# EAGLE design connect24x16 (EAGLE 5.11)
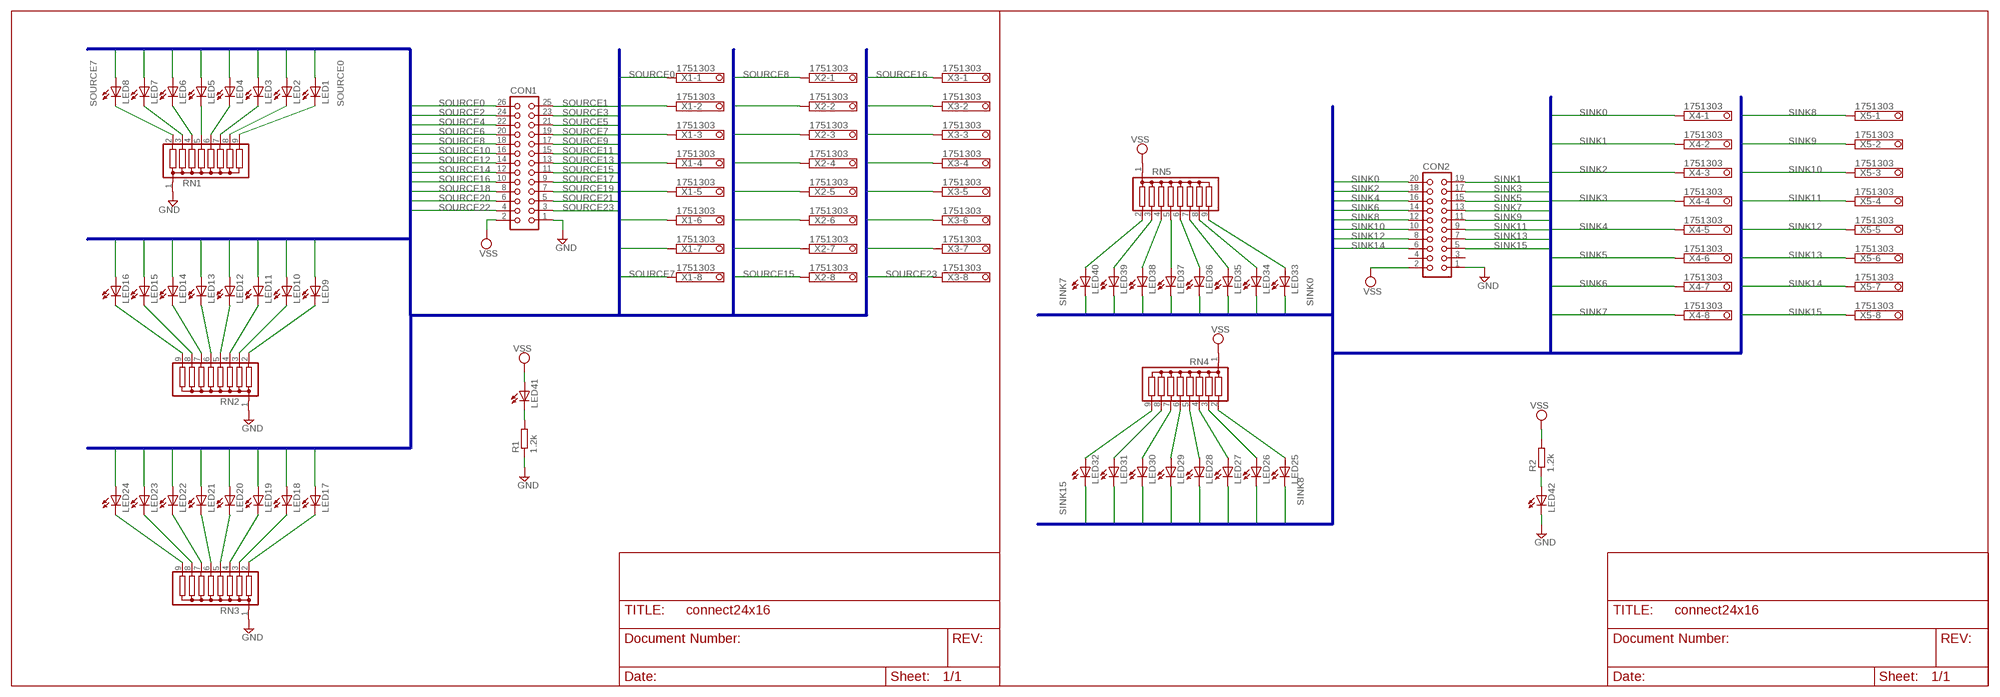
[diagram p0: schematic, sheet 1]

## Parts
CON1  CON-HARTING_CON26L  [CON-HARTING_CON26L]
CON2  CON-HARTING_CON20L  [CON-HARTING_CON20L]
LED1  LEDLZR181  [LZR181]
LED2  LEDLZR181  [LZR181]
LED3  LEDLZR181  [LZR181]
LED4  LEDLZR181  [LZR181]
LED5  LEDLZR181  [LZR181]
LED6  LEDLZR181  [LZR181]
LED7  LEDLZR181  [LZR181]
LED8  LEDLZR181  [LZR181]
LED9  LEDLZR181  [LZR181]
LED10  LEDLZR181  [LZR181]
LED11  LEDLZR181  [LZR181]
LED12  LEDLZR181  [LZR181]
LED13  LEDLZR181  [LZR181]
LED14  LEDLZR181  [LZR181]
LED15  LEDLZR181  [LZR181]
LED16  LEDLZR181  [LZR181]
LED17  LEDLZR181  [LZR181]
LED18  LEDLZR181  [LZR181]
LED19  LEDLZR181  [LZR181]
LED20  LEDLZR181  [LZR181]
LED21  LEDLZR181  [LZR181]
LED22  LEDLZR181  [LZR181]
LED23  LEDLZR181  [LZR181]
LED24  LEDLZR181  [LZR181]
LED25  LEDLZR181  [LZR181]
LED26  LEDLZR181  [LZR181]
LED27  LEDLZR181  [LZR181]
LED28  LEDLZR181  [LZR181]
LED29  LEDLZR181  [LZR181]
LED30  LEDLZR181  [LZR181]
LED31  LEDLZR181  [LZR181]
LED32  LEDLZR181  [LZR181]
LED33  LEDLZR181  [LZR181]
LED34  LEDLZR181  [LZR181]
LED35  LEDLZR181  [LZR181]
LED36  LEDLZR181  [LZR181]
LED37  LEDLZR181  [LZR181]
LED38  LEDLZR181  [LZR181]
LED39  LEDLZR181  [LZR181]
LED40  LEDLZR181  [LZR181]
LED41  LED3MM  [LED3MM]
LED42  LED3MM  [LED3MM]
R1  1.2k  R-EU_0207/10  [0207/10]
R2  1.2k  R-EU_0207/10  [0207/10]
RN1  G08R  [SIL9]
RN2  G08R  [SIL9]
RN3  G08R  [SIL9]
RN4  G08R  [SIL9]
RN5  G08R  [SIL9]
X1  1751303  [1751303]
X2  1751303  [1751303]
X3  1751303  [1751303]
X4  1751303  [1751303]
X5  1751303  [1751303]

## Nets
GND1: CON1.1 R1.1 RN1.1 RN2.1 RN3.1 ; supply symbol labelled GND
GND2: CON2.1 LED42.K(C) ; supply symbol labelled GND
N$1: LED8.K(C) RN1.2
N$2: LED7.K(C) RN1.3
N$3: LED6.K(C) RN1.4
N$4: LED5.K(C) RN1.5
N$5: LED4.K(C) RN1.6
N$6: LED3.K(C) RN1.7
N$7: LED2.K(C) RN1.8
N$8: LED1.K(C) RN1.9
N$9: LED16.K(C) RN2.9
N$10: LED15.K(C) RN2.8
N$11: LED14.K(C) RN2.7
N$12: LED13.K(C) RN2.6
N$13: LED12.K(C) RN2.5
N$14: LED11.K(C) RN2.4
N$15: LED10.K(C) RN2.3
N$16: LED9.K(C) RN2.2
N$17: LED24.K(C) RN3.9
N$18: LED23.K(C) RN3.8
N$19: LED22.K(C) RN3.7
N$20: LED21.K(C) RN3.6
N$21: LED20.K(C) RN3.5
N$22: LED19.K(C) RN3.4
N$23: LED18.K(C) RN3.3
N$24: LED17.K(C) RN3.2
N$25: LED41.K(C) R1.2
N$26: LED40.A RN5.2
N$27: LED39.A RN5.3
N$28: LED38.A RN5.4
N$29: LED32.A RN4.9
N$30: LED31.A RN4.8
N$31: LED30.A RN4.7
N$32: LED29.A RN4.6
N$33: LED28.A RN4.5
N$34: LED27.A RN4.4
N$35: LED26.A RN4.3
N$36: LED25.A RN4.2
N$37: LED37.A RN5.5
N$38: LED36.A RN5.6
N$39: LED35.A RN5.7
N$40: LED34.A RN5.8
N$41: LED33.A RN5.9
N$42: LED42.A R2.1
SINK0: CON2.20 LED33.K(C) X4.1
SINK1: CON2.19 LED34.K(C) X4.2
SINK2: CON2.18 LED35.K(C) X4.3
SINK3: CON2.17 LED36.K(C) X4.4
SINK4: CON2.16 LED37.K(C) X4.5
SINK5: CON2.15 LED38.K(C) X4.6
SINK6: CON2.14 LED39.K(C) X4.7
SINK7: CON2.13 LED40.K(C) X4.8
SINK8: CON2.12 LED25.K(C) X5.1
SINK9: CON2.11 LED26.K(C) X5.2
SINK10: CON2.10 LED27.K(C) X5.3
SINK11: CON2.9 LED28.K(C) X5.4
SINK12: CON2.8 LED29.K(C) X5.5
SINK13: CON2.7 LED30.K(C) X5.6
SINK14: CON2.6 LED31.K(C) X5.7
SINK15: CON2.5 LED32.K(C) X5.8
SOURCE0: CON1.26 LED1.A X1.1
SOURCE1: CON1.25 LED2.A X1.2
SOURCE2: CON1.24 LED3.A X1.3
SOURCE3: CON1.23 LED4.A X1.4
SOURCE4: CON1.22 LED5.A X1.5
SOURCE5: CON1.21 LED6.A X1.6
SOURCE6: CON1.20 LED7.A X1.7
SOURCE7: CON1.19 LED8.A X1.8
SOURCE8: CON1.18 LED9.A X2.1
SOURCE9: CON1.17 LED10.A X2.2
SOURCE10: CON1.16 LED11.A X2.3
SOURCE11: CON1.15 LED12.A X2.4
SOURCE12: CON1.14 LED13.A X2.5
SOURCE13: CON1.13 LED14.A X2.6
SOURCE14: CON1.12 LED15.A X2.7
SOURCE15: CON1.11 LED16.A X2.8
SOURCE16: CON1.10 LED17.A X3.1
SOURCE17: CON1.9 LED18.A X3.2
SOURCE18: CON1.8 LED19.A X3.3
SOURCE19: CON1.7 LED20.A X3.4
SOURCE20: CON1.6 LED21.A X3.5
SOURCE21: CON1.5 LED22.A X3.6
SOURCE22: CON1.4 LED23.A X3.7
SOURCE23: CON1.3 LED24.A X3.8
VSS: CON1.2 CON2.2 LED41.A R2.2 RN4.1 RN5.1
Unconnected: CON2.3 CON2.4

## Buses
SOURCE[0..23]
SINK[0..15]

## Library data of the parts
CON1 = connect24x16:CON-HARTING_CON26L: CONNECTOR
CON2 = connect24x16:CON-HARTING_CON20L: CONNECTOR
LED1-LED42 = led:LED: LED OSRAM: - CHIPLED LG R971, LG N971, LY N971, LG Q971, LY Q971, LO R971, LY R971 LH N974, LH R974 LS Q976, LO Q976, LY Q976 LO Q996 - Hyper CHIPLED LW Q18S LB Q993, LB Q99A, LB R99A - SideLED LS A670, LO A670, LY A670, LG A670, LP A670 LB A673, LV A673, LT A673, LW A673 LH A674 LY A675 LS A676, LA A676, LO A676, LY A676, LW A676 LS A679, LY A679, LG A679 - Hyper Micro SIDELED® LS Y876, LA Y876, LO Y876, LY Y876 LT Y87S - SmartLED LW L88C, LW L88S LB L89C, LB L89S, LG L890 LS L89K, LO L89K, LY L89K LS L896, LA L896, LO L896, LY L896 - TOPLED LS T670, LO T670, LY T670, LG T670, LP T670 LSG T670, LSP T670, LSY T670, LOP T670, LYG T670 LG T671, LOG T671, LSG T671 LB T673, LV T673, LT T673, LW T673 LH T674 LS T676, LA T676, LO T676, LY T676, LB T676, LH T676, LSB T676, LW T676 LB T67C, LV T67C, LT T67C, LS T67K, LO T67K, LY T67K, LW E67C LS E67B, LA E67B, LO E67B, LY E67B, LB E67C, LV E67C, LT E67C LW T67C LS T679, LY T679, LG T679 LS T770, LO T770, LY T770, LG T770, LP T770 LB T773, LV T773, LT T773, LW T773 LH T774 LS E675, LA E675, LY E675, LS T675 LS T776, LA T776, LO T776, LY T776, LB T776 LHGB T686 LT T68C, LB T68C - Hyper Mini TOPLED® LB M676 - Mini TOPLED Santana® LG M470 LS M47K, LO M47K, LY M47K Source: http://www.osram.convergy.de LUXEON: - LUMILED® LXK2-PW12-R00, LXK2-PW12-S00, LXK2-PW14-U00, LXK2-PW14-V00 LXK2-PM12-R00, LXK2-PM12-S00, LXK2-PM14-U00 LXK2-PE12-Q00, LXK2-PE12-R00, LXK2-PE12-S00, LXK2-PE14-T00, LXK2-PE14-U00 LXK2-PB12-K00, LXK2-PB12-L00, LXK2-PB12-M00, LXK2-PB14-N00, LXK2-PB14-P00, LXK2-PB14-Q00 LXK2-PR12-L00, LXK2-PR12-M00, LXK2-PR14-Q00, LXK2-PR14-R00 LXK2-PD12-Q00, LXK2-PD12-R00, LXK2-PD12-S00 LXK2-PH12-R00, LXK2-PH12-S00 LXK2-PL12-P00, LXK2-PL12-Q00, LXK2-PL12-R00 Source: www.luxeon.com KINGBRIGHT: KA-3528ASYC Source: www.kingbright.com
R1 R2 = rcl:R-EU_: RESISTOR, European symbol
RN1-RN5 = resistor-sil:G08R: SIL RESISTOR
X1-X5 = con-phoenix-350:1751303: MKDS 1/ 8-3,5 Printklemme Nennstrom: 10 A Bemessungsspannung: 160 V Raster: 3,5 mm Polzahl: 8 Montageart: Löten Anschlussart: Schraubanschluss Anschlussrichtung vom Leiter zur Platine: 0° Source: http://eshop.phoenixcontact.com .. .pdf

## Board
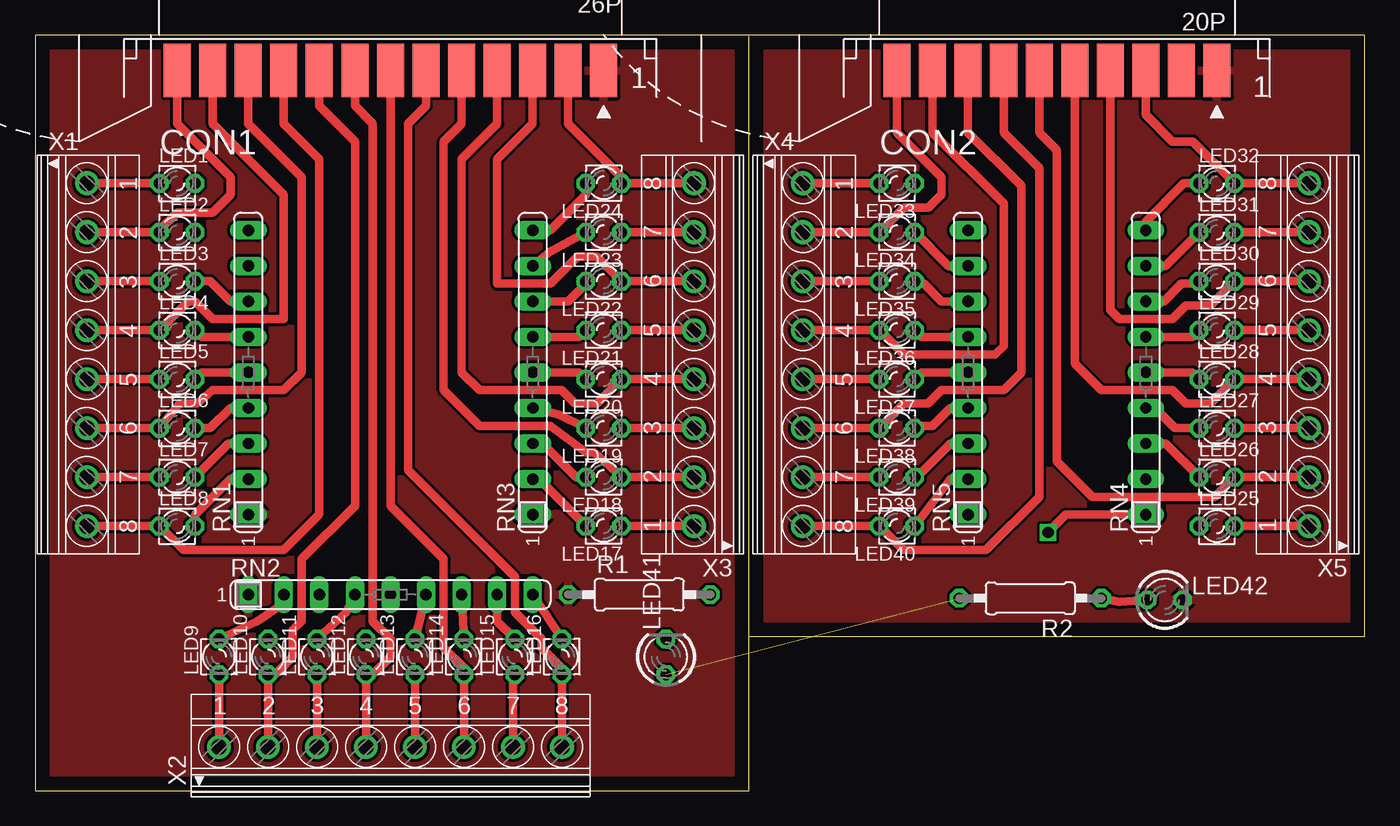
[diagram p1: board, top side]
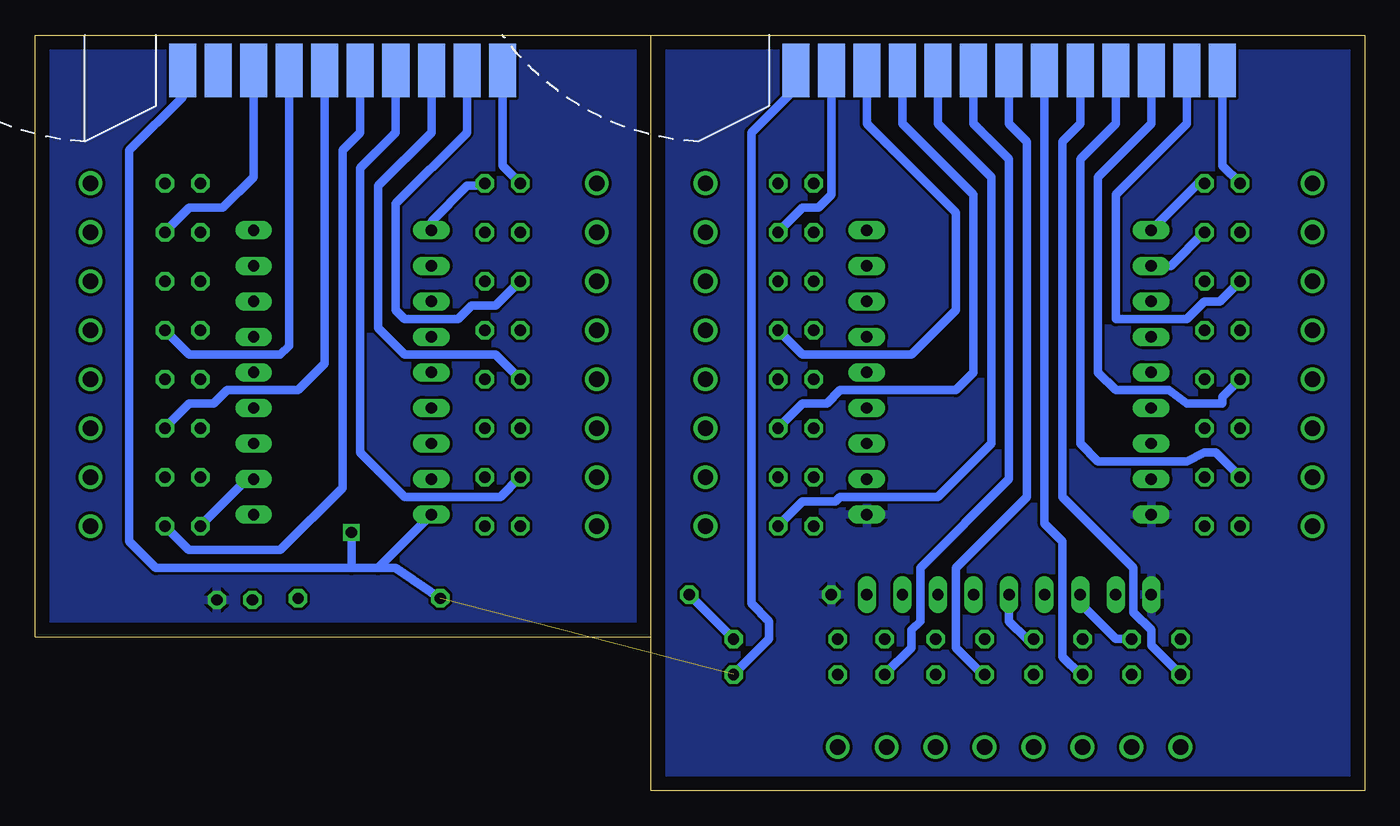
[diagram p2: board, bottom side, seen from below]

Size 95 x 54 mm. Coordinates in mm from the lower left corner, seen from the top.
Outline: 51,11 51,0 0,0 0,54 95,54 95,11 51,11
Outline: 51,11 51,54
Copper layers (1*16): Top 0.035mm / dielectric 1.5mm / Bottom 0.035mm
Design rules "default": minimum track width 10mil, minimum drill 24mil, track to track 8mil, track to pad 8mil, pad to pad 8mil, via to via 8mil, smd to smd 8mil, copper to edge 40mil, drill to drill 8mil, minimum pad ring 10mil, minimum via ring 8mil, stop-mask expansion 4mil, vias tented up to drill 0mil, thermal gap 10mil

### Footprints (pad centres in the part's own frame; a part is rotated, then mirrored left to right if it is on the bottom)
CON-HARTING_CON26L = smd 1.93 x 3.81: 1 15.24,-2.54; 3 12.7,-2.54; 5 10.16,-2.54; 7 7.62,-2.54; 9 5.08,-2.54; 11 2.54,-2.54; 13 0,-2.54; 15 -2.54,-2.54; 17 -5.08,-2.54; 19 -7.62,-2.54; 21 -10.16,-2.54; 23 -12.7,-2.54; 25 -15.24,-2.54 | smd 1.93 x 3.81 bottom: 2 15.24,-2.54; 4 12.7,-2.54; 6 10.16,-2.54; 8 7.62,-2.54; 10 5.08,-2.54; 12 2.54,-2.54; 14 0,-2.54; 16 -2.54,-2.54; 18 -5.08,-2.54; 20 -7.62,-2.54; 22 -10.16,-2.54; 24 -12.7,-2.54; 26 -15.24,-2.54
CON-HARTING_CON20L = smd 1.93 x 3.81: 1 11.43,-2.54; 3 8.89,-2.54; 5 6.35,-2.54; 7 3.81,-2.54; 9 1.27,-2.54; 11 -1.27,-2.54; 13 -3.81,-2.54; 15 -6.35,-2.54; 17 -8.89,-2.54; 19 -11.43,-2.54 | smd 1.93 x 3.81 bottom: 2 11.43,-2.54; 4 8.89,-2.54; 6 6.35,-2.54; 8 3.81,-2.54; 10 1.27,-2.54; 12 -1.27,-2.54; 14 -3.81,-2.54; 16 -6.35,-2.54; 18 -8.89,-2.54; 20 -11.43,-2.54
LZR181 = drill 0.813 octagon: A -1.27,0; K 1.27,0
LED3MM = drill 0.813 octagon: A -1.27,0; K 1.27,0
0207/10 = drill 0.813 octagon: 1 -5.08,0; 2 5.08,0
SIL9 = drill 0.813 long: 1 -10.16,0; 2 -7.62,0; 3 -5.08,0; 4 -2.54,0; 5 0,0; 6 2.54,0; 7 5.08,0; 8 7.62,0; 9 10.16,0
1751303 = drill 1.1 pad 1.7 round: 1 -12.25,-0.1; 2 -8.75,-0.1; 3 -5.25,-0.1; 4 -1.75,-0.1; 5 1.75,-0.1; 6 5.25,-0.1; 7 8.75,-0.1; 8 12.25,-0.1

### Placement (x,y rotation side)
CON1  25.4,54 0 top
CON2  73.03,54 0 top
LED1  10.16,43.4 0 top
LED2  10.16,39.9 0 top
LED3  10.16,36.4 0 top
LED4  10.16,32.9 0 top
LED5  10.16,29.4 0 top
LED6  10.16,25.9 0 top
LED7  10.16,22.4 0 top
LED8  10.16,18.9 0 top
LED9  13.15,9.56 90 top
LED10  16.65,9.56 90 top
LED11  20.15,9.56 90 top
LED12  23.65,9.56 90 top
LED13  27.15,9.56 90 top
LED14  30.65,9.56 90 top
LED15  34.29,9.56 90 top
LED16  37.65,9.56 90 top
LED17  40.64,18.9 180 top
LED18  40.64,22.4 180 top
LED19  40.64,25.9 180 top
LED20  40.64,29.4 180 top
LED21  40.64,32.9 180 top
LED22  40.64,36.4 180 top
LED23  40.64,39.9 180 top
LED24  40.64,43.4 180 top
LED25  84.45,18.9 0 top
LED26  84.45,22.4 0 top
LED27  84.45,25.9 0 top
LED28  84.45,29.4 0 top
LED29  84.45,32.9 0 top
LED30  84.45,36.4 0 top
LED31  84.45,39.9 0 top
LED32  84.45,43.4 0 top
LED33  61.59,43.4 180 top
LED34  61.59,39.9 180 top
LED35  61.59,36.4 180 top
LED36  61.59,32.9 180 top
LED37  61.59,29.4 180 top
LED38  61.59,25.9 180 top
LED39  61.59,22.4 180 top
LED40  61.59,18.9 180 top
LED41  45.09,9.56 90 top
LED42  80.73,13.62 0 top
R1  43.18,14.01 0 top
R2  71.12,13.73 180 top
RN1  15.24,29.88 90 top
RN2  25.4,14.01 0 top
RN3  35.56,29.88 90 top
RN4  79.38,29.88 90 top
RN5  66.67,29.88 90 top
X1  3.81,31.15 270 top
X2  25.4,3.21 0 top
X3  46.99,31.15 90 top
X4  54.96,31.15 270 top
X5  90.93,31.15 90 top

### Tracks (layer width: path | path; a pad name or v marks a point on that pad's centre or on a via)
GND1
  pour Bottom: 1,54 50,54 50,1 1,1
  pour Top: 1,54 50,54 50,1 1,1
GND2
  pour Bottom: 52,54 94,54 94,12 52,12
  pour Top: 52,54 94,54 94,12 52,12
N$1
  Top 0.61: LED8.K 11.43,19.72 13.97,22.26 RN1.2
N$2
  Top 0.61: LED7.K 13.83,24.8 RN1.3
N$3
  Top 0.61: LED6.K 12.53,25.9 13.97,27.34 RN1.4
N$4
  Top 0.61: LED5.K 11.91,29.88 RN1.5
N$5
  Top 0.61: LED4.K 11.91,32.42 RN1.6
N$6
  Top 0.61: LED3.K 12.53,36.4 13.97,34.96 RN1.7
N$7
  Bottom 0.61: RN1.8 13.83,37.5 LED2.K
N$8
  Bottom 0.61: LED1.K 11.88,43.4 RN1.9
N$9
  Top 0.61: LED16.K RN2.9
N$10
  Top 0.61: LED15.K 33.02,12.1 RN2.8
N$11
  Top 0.61: LED14.K RN2.7
N$12
  Top 0.61: LED13.K RN2.6
N$13
  Bottom 0.61: LED12.K 24.13,10.83 25.4,12.1 RN2.5
N$14
  Top 0.61: LED11.K 22.23,12.73 RN2.4
N$15
  Bottom 0.61: LED10.K 17.78,10.83 20.32,13.37 RN2.3
N$16
  Top 0.61: LED9.K 15.88,12.1 17.78,13.37 RN2.2
N$17
  Top 0.61: LED24.K 39.37,42.58 36.83,40.04 RN3.9
N$18
  Top 0.61: LED23.K 36.77,38.5 RN3.8
N$19
  Top 0.61: LED22.K 39.37,36.23 38.1,34.96 RN3.7
N$20
  Top 0.61: RN3.6 38.89,32.42 LED21.K
N$21
  Top 0.61: RN3.5 38.89,29.88 LED20.K
N$22
  Top 0.61: LED19.K 37.41,26.89 RN3.4
N$23
  Top 0.61: RN3.3 36.27,24.8 38.7,22.38 39.34,22.38 LED18.K
N$24
  Top 0.61: RN3.2 36.01,22.26 LED17.K
N$25
  Bottom 0.61: LED41.K R1.2
N$26
  Top 0.61: LED40.A 65.41,22.26 RN5.2
N$27
  Top 0.61: LED39.A 63.01,22.4 65.41,24.8 RN5.3
N$28
  Top 0.61: RN5.4 65.41,27.34 64.14,26.07 63.03,26.07 LED38.A
N$29
  Top 0.61: RN4.9 79.38,40.67 82.1,43.4 LED32.A
N$30
  Top 0.61: RN4.8 80.78,37.5 LED31.A
N$31
  Top 0.61: RN4.7 80.64,34.96 81.92,36.23 83.02,36.23 LED30.A
N$32
  Top 0.61: RN4.6 82.7,32.42 LED29.A
N$33
  Top 0.61: RN4.5 82.7,29.88 LED28.A
N$34
  Top 0.61: RN4.4 80.01,27.34 81.45,25.9 LED27.A
N$35
  Top 0.61: RN4.3 80.78,24.8 LED26.A
N$36
  Bottom 0.61: RN4.2 79.83,22.26 LED25.A
N$37
  Top 0.61: RN5.5 63.34,29.88 LED37.A
N$38
  Top 0.61: RN5.6 63.34,32.42 LED36.A
N$39
  Top 0.61: RN5.7 64.77,34.96 63.5,36.23 63.03,36.23 LED35.A
N$40
  Top 0.61: RN5.8 65.27,37.5 LED34.A
N$41
  Bottom 0.61: RN5.9 66.67,40.67 64.14,43.22 63.05,43.22 LED33.A
N$42
  Top 0.61: R2.1 77.47,13.47 LED42.A
SINK0
  Top 0.61: X4.1 LED33.K
  Bottom 0.61: CON2.20 61.59,44.67 LED33.K
SINK1
  Top 0.61: X4.2 LED34.K 62.08,41.65 63.84,41.65 64.77,42.58 64.77,43.85 61.59,47.03 CON2.19
SINK2
  Top 0.61: X4.3 LED35.K
  Bottom 0.61: CON2.18 64.14,47.03 69.22,41.94 69.22,34.33 68.58,33.69 64.77,33.69 63.81,34.65 62.08,34.65 LED35.K
SINK3
  Top 0.61: X4.4 LED36.K 62.08,31.15 68.58,31.15 69.22,31.78 69.22,41.94 64.14,47.03 CON2.17
SINK4
  Top 0.61: X4.5 LED37.K
  Bottom 0.61: CON2.16 66.67,47.03 70.48,43.22 70.48,33.05 68.58,31.15 62.08,31.15 LED37.K
SINK5
  Top 0.61: X4.6 LED38.K 62.08,27.65 63.81,27.65 64.77,28.61 69.22,28.61 70.48,29.88 70.48,43.22 66.67,47.03 CON2.15
SINK6
  Top 0.61: X4.7 LED39.K
  Bottom 0.61: CON2.14 69.22,47.03 71.75,44.48 71.75,24.16 68.58,20.99 61.73,20.99 LED39.K
SINK7
  Top 0.61: X4.8 LED40.K 62.05,17.18 67.94,17.18 71.75,20.99 71.75,44.48 69.22,47.03 CON2.13
SINK8
  Top 0.61: LED25.K X5.1
  Bottom 0.61: CON2.12 71.75,47.03 73.03,45.75 73.03,21.62 77.47,17.18 84,17.18 LED25.K
SINK9
  Top 0.61: CON2.11 71.75,47.03 73.03,45.75 73.03,23.53 75.56,20.99 84.31,20.99 LED26.K X5.2
SINK10
  Top 0.61: LED27.K X5.3
  Bottom 0.61: CON2.10 74.3,30.52 76.2,28.61 81.28,28.61 82.24,27.65 83.02,27.65 83.19,27.65 83.97,27.65 LED27.K
SINK11
  Top 0.61: CON2.9 74.3,30.52 76.2,28.61 81.28,28.61 82.24,27.65 83.97,27.65 LED28.K X5.4
SINK12
  Top 0.61: LED29.K X5.5
  Bottom 0.61: CON2.8 76.83,31.78 77.47,31.15 83.97,31.15 LED29.K
SINK13
  Top 0.61: CON2.7 76.83,34.33 77.47,33.69 81.28,33.69 82.24,34.65 83.97,34.65 LED30.K X5.6
SINK14
  Top 0.61: LED31.K X5.7
  Bottom 0.61: CON2.6 79.38,43.85 81.58,41.65 83.97,41.65 LED31.K
SINK15
  Top 0.61: X5.8 LED32.K 82.73,46.39 81.28,46.39 79.38,48.3 CON2.5
SOURCE0
  Top 0.61: X1.1 LED1.A
  Bottom 0.61: CON1.26 10.16,44.67 LED1.A
SOURCE1
  Top 0.61: CON1.25 10.16,47.66 13.97,43.85 13.97,42.58 12.7,41.31 10.16,41.31 8.89,40.04 LED2.A X1.2
SOURCE2
  Top 0.61: X1.3 LED3.A
  Bottom 0.61: CON1.24 12.7,47.66 17.78,42.58 17.78,33.69 12.7,33.69 11.43,34.96 10.33,34.96 LED3.A
SOURCE3
  Top 0.61: CON1.23 12.7,47.66 17.78,42.58 17.78,33.69 12.7,33.69 11.43,34.96 10.95,34.96 LED4.A X1.4
SOURCE4
  Top 0.61: X1.5 LED5.A
  Bottom 0.61: CON1.22 15.24,47.66 19.05,43.85 19.05,29.88 17.78,28.61 13.97,28.61 12.7,27.65 10.16,27.65 10.16,28.13 LED5.A
SOURCE5
  Top 0.61: CON1.21 15.24,47.66 19.05,43.85 19.05,29.88 17.78,28.61 12.7,28.61 11.6,27.65 10.33,27.65 LED6.A X1.6
SOURCE6
  Top 0.61: X1.7 LED7.A
  Bottom 0.61: CON1.20 17.78,47.66 20.32,45.12 20.32,24.8 19.05,23.53 12.7,23.53 11.43,24.15 10.64,24.15 LED7.A
SOURCE7
  Top 0.61: CON1.19 17.78,47.66 20.32,45.12 20.32,19.72 17.78,17.18 10.61,17.18 LED8.A X1.8
SOURCE8
  Top 0.61: X2.1 LED9.A
  Bottom 0.61: CON1.18 20.32,47.66 21.59,46.39 21.59,20.99 16.51,15.91 16.51,12.73 15.24,11.47 15.24,10.38 LED9.A
SOURCE9
  Top 0.61: CON1.17 20.32,48.93 22.86,46.39 22.86,20.35 19.05,16.55 19.05,12.1 18.41,11.47 18.41,9.56 17.14,8.29 LED10.A X2.2
SOURCE10
  Top 0.61: X2.3 LED11.A
  Bottom 0.61: LED11.A 20.32,8.29 21.59,9.56 21.59,17.81 22.86,19.09 CON1.16
SOURCE11
  Top 0.61: CON1.15 22.86,48.93 24.13,47.66 24.13,12.1 25.4,10.83 25.4,9.56 24.13,8.29 LED12.A X2.4
SOURCE12
  Top 0.61: X2.5 LED13.A
  Bottom 0.61: CON1.14 25.4,47.66 24.13,46.39 24.13,20.99 29.21,15.91 29.21,10.2 27.3,8.29 LED13.A
SOURCE13
  Top 0.61: X2.6 LED14.A 30.65,8.76 29.21,10.2 29.21,16.55 25.4,20.35 CON1.13
SOURCE14
  Top 0.61: X2.7 34.15,8.15 LED15.A
  Bottom 0.61: CON1.12 27.94,47.66 25.4,45.12 25.4,22.26 31.75,15.91 31.75,12.1 32.38,11.47 32.38,10.2 LED15.A
SOURCE15
  Top 0.61: CON1.11 27.94,48.93 26.67,47.66 26.67,22.9 34.29,15.27 34.29,12.73 36.2,10.83 36.2,10.2 37.65,8.74 LED16.A X2.8
SOURCE16
  Top 0.61: LED17.A X3.1
  Bottom 0.61: CON1.10 30.48,47.66 26.67,43.85 26.67,24.8 30.48,20.99 37.47,20.99 37.8,20.65 40.16,20.65 LED17.A
SOURCE17
  Top 0.61: X3.2 LED18.A 39.99,24.15 39.39,24.15 36.83,26.07 31.75,26.07 29.21,28.61 29.21,46.39 30.48,47.66 CON1.9
SOURCE18
  Top 0.61: LED19.A X3.3
  Bottom 0.61: CON1.8 33.02,47.66 27.94,42.58 27.94,29.88 29.21,28.61 37.47,28.61 38.42,27.65 40.16,27.65 LED19.A
SOURCE19
  Top 0.61: X3.4 LED20.A 40.16,27.65 38.59,27.65 37.62,28.61 31.75,28.61 30.48,29.88 30.48,45.12 33.02,47.66 CON1.7
SOURCE20
  Top 0.61: LED21.A X3.5
  Bottom 0.61: CON1.6 35.56,47.66 29.21,41.31 29.21,34.33 32.38,31.15 40.16,31.15 LED21.A
SOURCE21
  Top 0.61: X3.6 LED22.A 40.16,38.15 40.03,38.15 39.99,38.15 38.75,38.15 36.83,36.23 33.02,36.23 33.02,45.12 35.56,47.66 CON1.5
SOURCE22
  Top 0.61: LED23.A X3.7
  Bottom 0.61: CON1.4 38.1,42.58 39.03,41.65 40.16,41.65 LED23.A
SOURCE23
  Top 0.61: X3.8 LED24.A 41.91,43.85 38.1,47.66 CON1.3
VSS  (via drill 0.8)  (1 unrouted)
  Top 0.61: RN4.1 73.66,19.72 v72.39,18.45
  Bottom 0.61: CON1.2 40.64,50.2 43.81,47.03 43.81,13.37 42.55,12.1 42.55,10.83 LED41.A | CON2.2 84.45,49.56 88.27,45.75 88.27,17.81 86.36,15.91 72.39,15.91 | 70.48,15.91 72.39,15.91 | 70.48,15.91 RN5.1 | 70.48,15.91 69.22,15.91 R2.2 | 72.39,15.91 v72.39,18.45